# EasyEDA schematic Vany.json
TITLE: Sheet_1; REV: 1.0; Date: 2020-03-31; Sheet: 1/1; Drawn By: dmitriyalekcandrovih; Company: Your Company
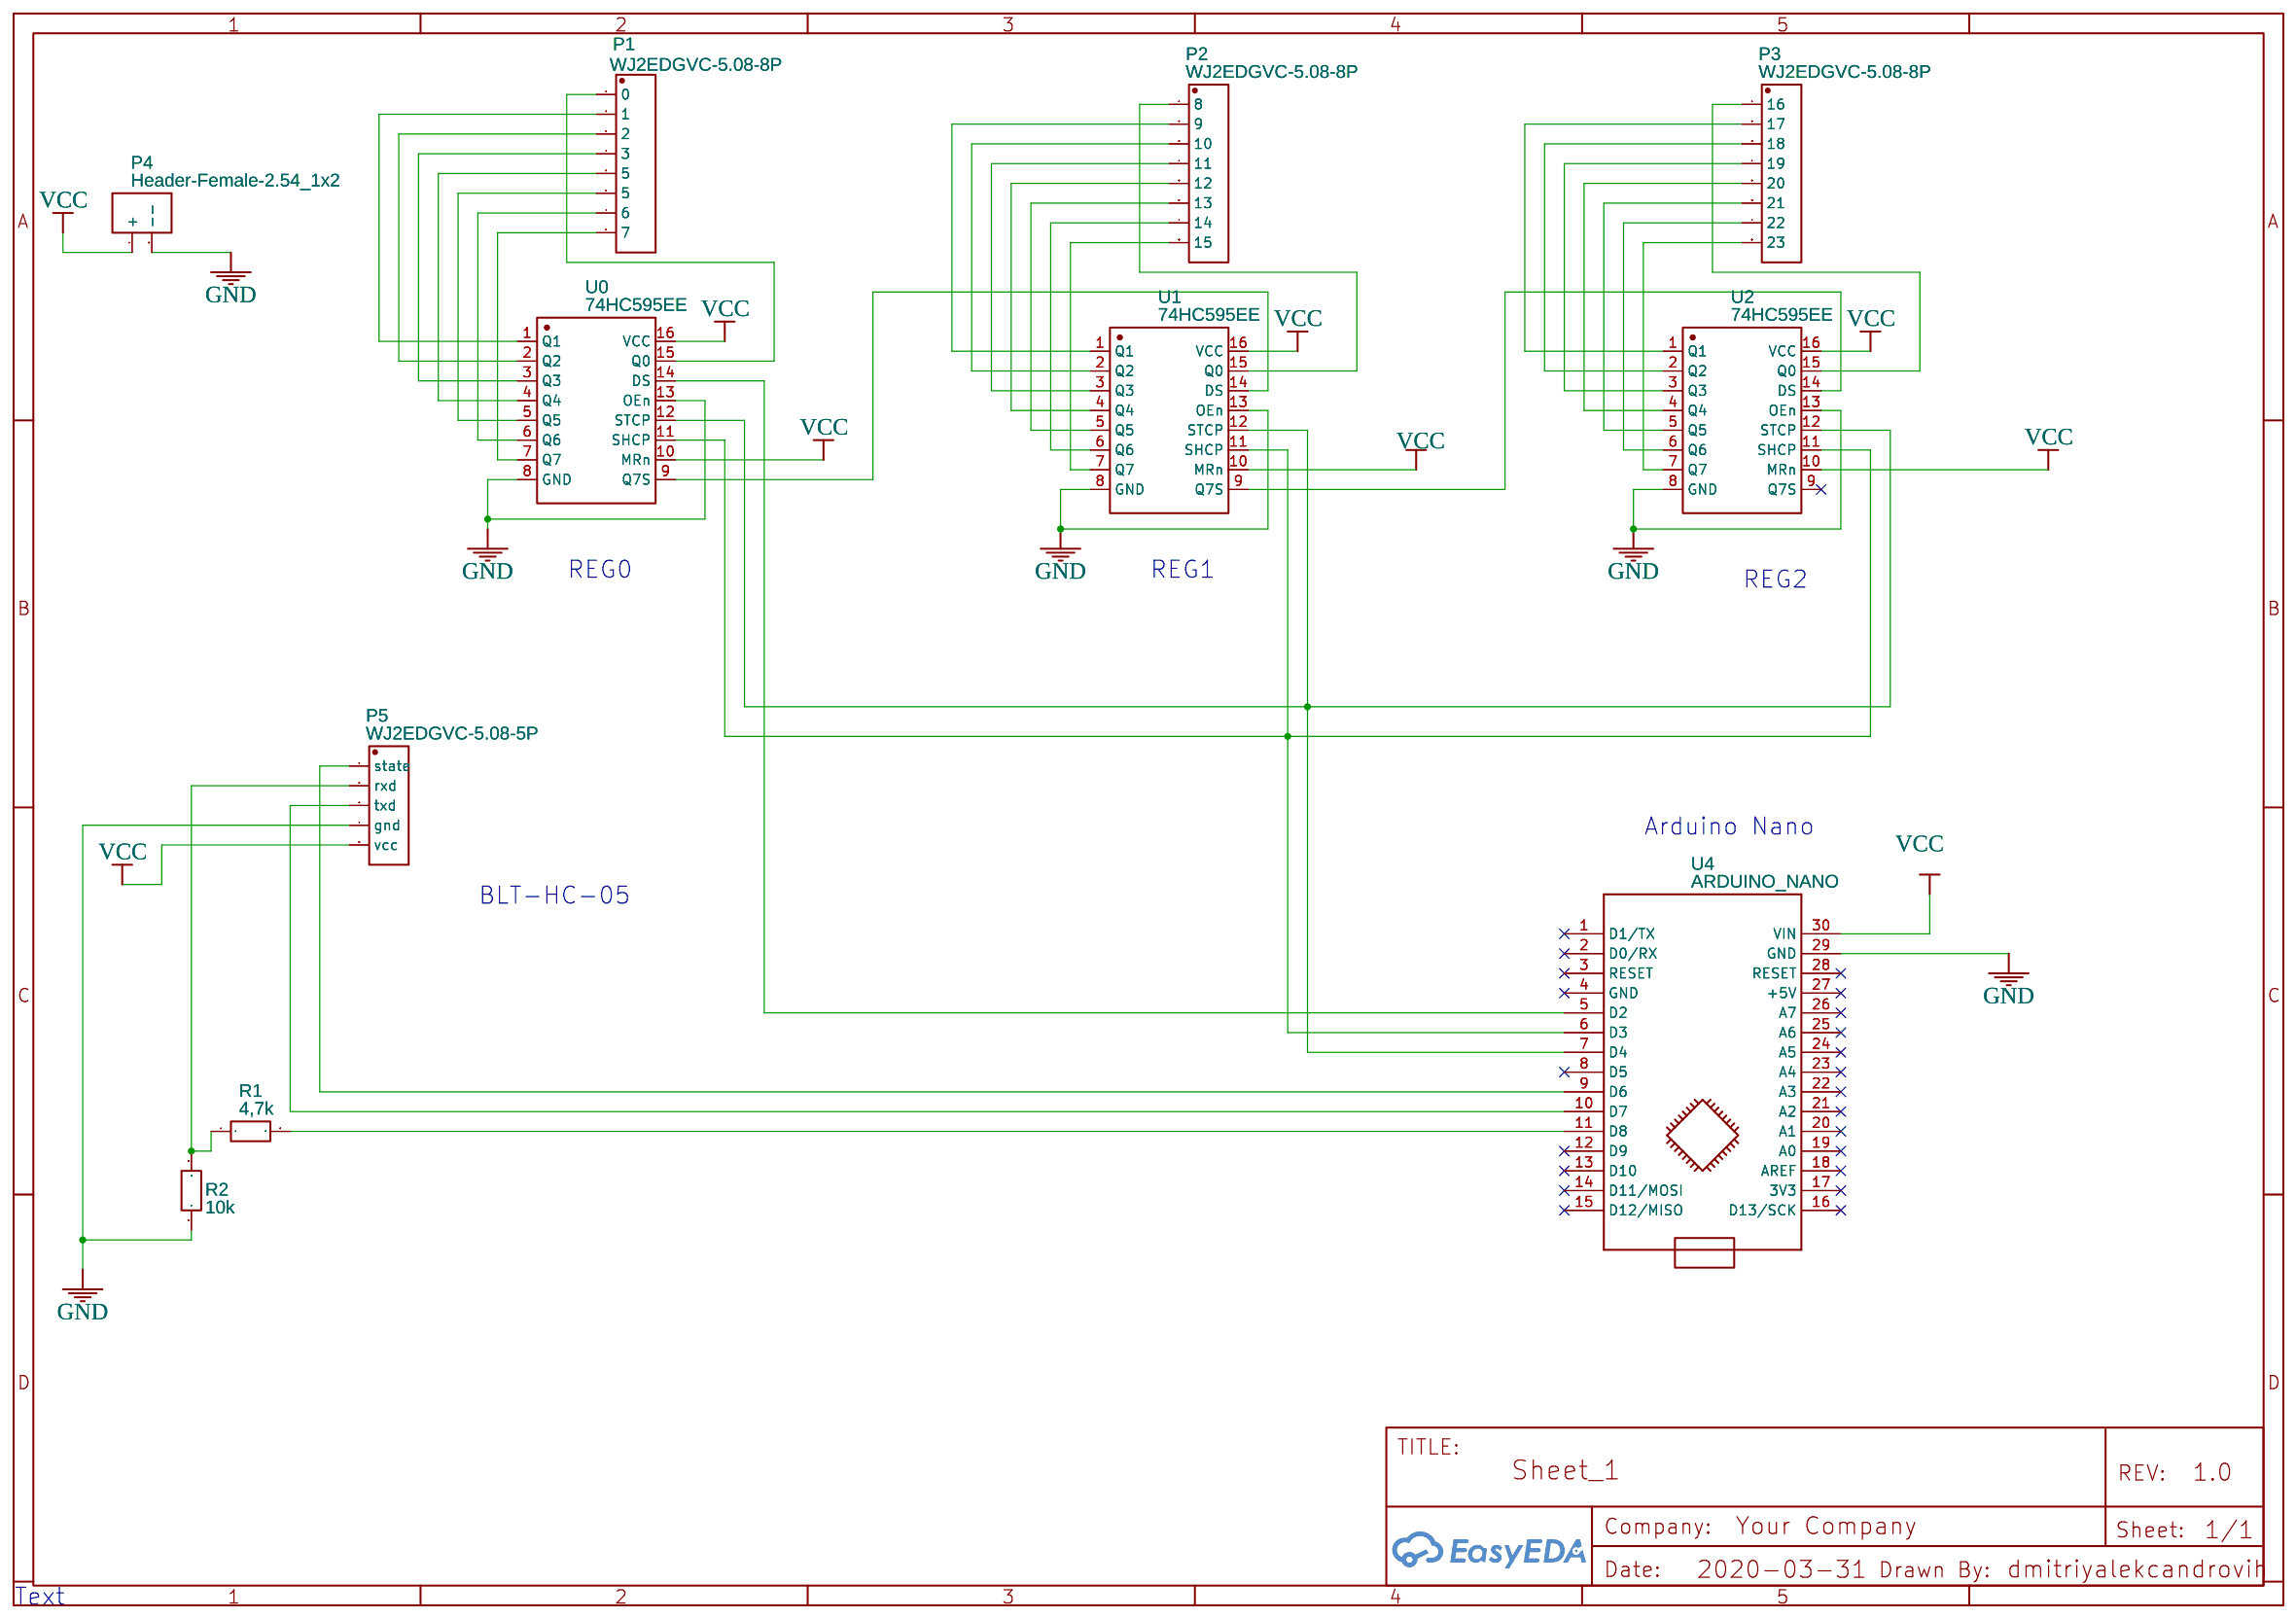
[diagram p0: schematic sheet]

## Parts
P1  WJ2EDGVC-5.08-8P  [WJ2EDGVC-5.08-8P]
P2  WJ2EDGVC-5.08-8P  [WJ2EDGVC-5.08-8P]
P3  WJ2EDGVC-5.08-8P  [WJ2EDGVC-5.08-8P]
P4  Header-Female-2.54_1x2  [HDR-TH_2P-P2.54-V-M]
P5  WJ2EDGVC-5.08-5P  [WJ2EDGVC-5.08-5P]
R1  4,7k  [AXIAL-0.3]
R2  10k  [AXIAL-0.3]
U0  74HC595EE  [DIP16]
U1  74HC595EE  [DIP16]
U2  74HC595EE  [DIP16]
U4  ARDUINO_NANO  [ARDUINO_NANO]

## Library data of the parts
P1-P3 = WJ2EDGVC-5.08-8P: Supplier: LCSC; Manufacturer: ReliaPro; image: //image.lceda.cn/szlcsc/C15084.jpg; Supplier Part: C15084
P4 = Header-Female-2.54_1x2: Supplier: LCSC; Manufacturer: BOOMELE; Manufacturer Part: 2.54-1*2PFemale; image: //image.lceda.cn/szlcsc/C49661.jpg; Supplier Part: C49661
P5 = WJ2EDGVC-5.08-5P: Supplier: LCSC; Manufacturer: ReliaPro; image: //image.lceda.cn/szlcsc/C8423.jpg; Supplier Part: C8423
R1 R2 = Res_AXIAL-0.3(1/8W)_EU
U0-U2 = 74HC595EE: Contributor: example; link: https://easyeda.com/example/Easy_logic_device_simulation_in_V2_3_x_onwards-RaKIG2oJ5
U4 = ARDUINO_NANO: sourceId: KGSeAWhDB

## Nets
GND: P4.2(--) P5.4(gnd) R2.1 U0.8(GND) U0.13(OEn) U1.8(GND) U1.13(OEn) U2.8(GND) U2.13(OEn) U4.29(GND)
VCC: P4.1(+) P5.5(vcc) U0.10(MRn) U0.16(VCC) U1.10(MRn) U1.16(VCC) U2.10(MRn) U2.16(VCC) U4.30(VIN)
Net-(P1-1): P1.1(0) U0.15(Q0)
Net-(P1-2): P1.2(1) U0.1(Q1)
Net-(P1-3): P1.3(2) U0.2(Q2)
Net-(P1-4): P1.4(3) U0.3(Q3)
Net-(P1-5): P1.5 U0.4(Q4)
Net-(P1-6): P1.6(5) U0.5(Q5)
Net-(P1-7): P1.7(6) U0.6(Q6)
Net-(P1-8): P1.8(7) U0.7(Q7)
Net-(P2-1): P2.1(8) U1.15(Q0)
Net-(P2-2): P2.2(9) U1.1(Q1)
Net-(P2-3): P2.3(10) U1.2(Q2)
Net-(P2-4): P2.4(11) U1.3(Q3)
Net-(P2-5): P2.5(12) U1.4(Q4)
Net-(P2-6): P2.6(13) U1.5(Q5)
Net-(P2-7): P2.7(14) U1.6(Q6)
Net-(P2-8): P2.8(15) U1.7(Q7)
Net-(P3-1): P3.1(16) U2.15(Q0)
Net-(P3-2): P3.2(17) U2.1(Q1)
Net-(P3-3): P3.3(18) U2.2(Q2)
Net-(P3-4): P3.4(19) U2.3(Q3)
Net-(P3-5): P3.5(20) U2.4(Q4)
Net-(P3-6): P3.6(21) U2.5(Q5)
Net-(P3-7): P3.7(22) U2.6(Q6)
Net-(P3-8): P3.8(23) U2.7(Q7)
Net-(P5-1): P5.1(state) U4.9(D6)
Net-(P5-2): P5.2(rxd) R1.1 R2.2
Net-(P5-3): P5.3(txd) U4.10(D7)
Net-(R1-2): R1.2 U4.11(D8)
Net-(U0-9): U0.9(Q7S) U1.14(DS)
Net-(U0-11): U0.11(SHCP) U1.11(SHCP) U2.11(SHCP) U4.6(D3)
Net-(U0-12): U0.12(STCP) U1.12(STCP) U2.12(STCP) U4.7(D4)
Net-(U0-14): U0.14(DS) U4.5(D2)
Net-(U1-9): U1.9(Q7S) U2.14(DS)

Not connected (* = marked no-connect by the designer): U2 9(Q7S)*; U4 1(D1/TX)* 2(D0/RX)* 3(RESET)* 4(GND)* 8(D5)* 12(D9)* 13(D10)* 14(D11/MOSI)* 15(D12/MISO)* 16(D13/SCK)* 17(3V3)* 18(AREF)* 19(A0)* 20(A1)* 21(A2)* 22(A3)* 23(A4)* 24(A5)* 25(A6)* 26(A7)* 27(+5V)* 28(RESET)*

## Notes on the sheet
- REG0
- REG1
- REG2
- Arduino Nano
- BLT-HC-05
- Text
